# EAGLE design usb-c_passthrough (EAGLE 9.4.2)
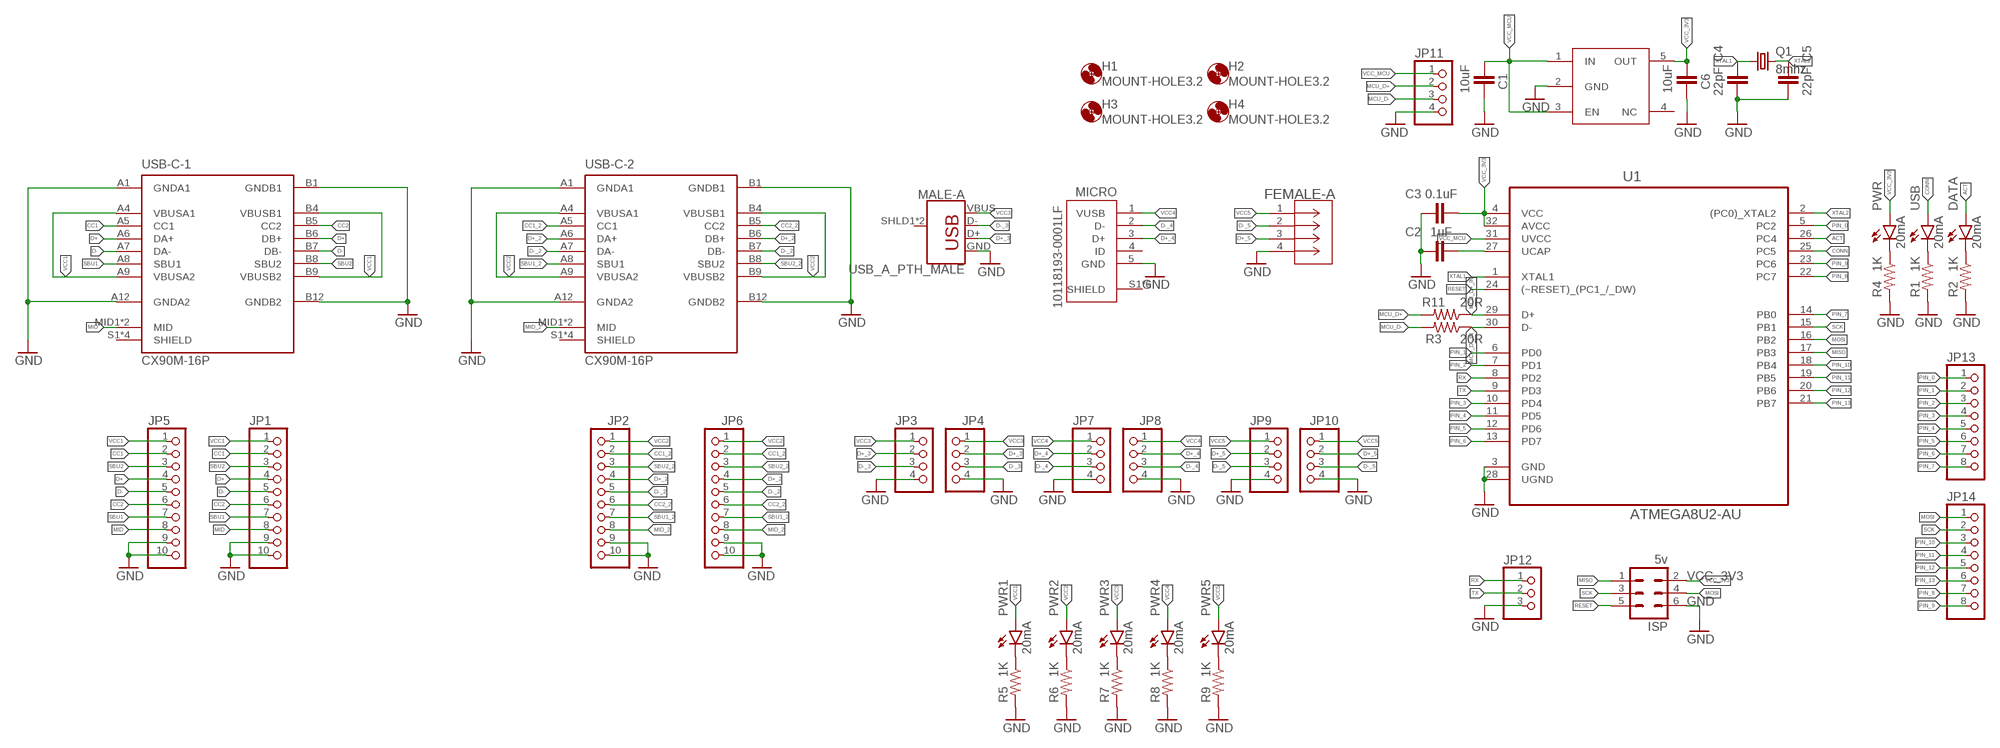
[diagram p0: schematic, sheet 1]

## Parts
3V3_REG  3v3 LDO  NCP718BSN330T1G  [NCP718BSN330T1G]
C1  10uF  C-EUC0603  [C0603]
C2  1uF  C-EUC0603  [C0603]
C3  0.1uF  C-EUC0603  [C0603]
C4  22pF  C-EUC0603  [C0603]
C5  22pF  C-EUC0603  [C0603]
C6  10uF  C-EUC0603  [C0603]
DATA  20mA  LEDCHIP-LED0603  [CHIP-LED0603]
FEMALE-A  292303-1  [CONN_292303-1]
H1  MOUNT-HOLE3.2  [3,2]
H2  MOUNT-HOLE3.2  [3,2]
H3  MOUNT-HOLE3.2  [3,2]
H4  MOUNT-HOLE3.2  [3,2]
ISP  5v  MA03-2  [MA03-2]
JP1  PINHD-1X10  [1X10]
JP2  PINHD-1X10  [1X10]
JP3  PINHD-1X4  [1X04]
JP4  PINHD-1X4  [1X04]
JP5  PINHD-1X10  [1X10]
JP6  PINHD-1X10  [1X10]
JP7  PINHD-1X4  [1X04]
JP8  PINHD-1X4  [1X04]
JP9  PINHD-1X4  [1X04]
JP10  PINHD-1X4  [1X04]
JP11  PINHD-1X4  [1X04]
JP12  PINHD-1X3  [1X03]
JP13  PINHD-1X8  [1X08]
JP14  PINHD-1X8  [1X08]
MALE-A  USB_A_PTH_MALE  [USB-A-H]
MICRO  10118193-0001LF  [FCI_10118193-0001LF]
PWR  20mA  LEDCHIP-LED0603  [CHIP-LED0603]
PWR1  20mA  LEDCHIP-LED0603  [CHIP-LED0603]
PWR2  20mA  LEDCHIP-LED0603  [CHIP-LED0603]
PWR3  20mA  LEDCHIP-LED0603  [CHIP-LED0603]
PWR4  20mA  LEDCHIP-LED0603  [CHIP-LED0603]
PWR5  20mA  LEDCHIP-LED0603  [CHIP-LED0603]
Q1  8mhz  CRYSTALHC49UP  [HC49UP]
R1  1K  10KOHM-0603-1/10W-1%  [0603]
R2  1K  10KOHM-0603-1/10W-1%  [0603]
R3  20R  10KOHM-0603-1/10W-1%  [0603]
R4  1K  10KOHM-0603-1/10W-1%  [0603]
R5  1K  10KOHM-0603-1/10W-1%  [0603]
R6  1K  10KOHM-0603-1/10W-1%  [0603]
R7  1K  10KOHM-0603-1/10W-1%  [0603]
R8  1K  10KOHM-0603-1/10W-1%  [0603]
R9  1K  10KOHM-0603-1/10W-1%  [0603]
R11  20R  10KOHM-0603-1/10W-1%  [0603]
U1  ATMEGA8U2-AU  [QFP80P900X900X120-32N]
USB  20mA  LEDCHIP-LED0603  [CHIP-LED0603]
USB-C-1  CX90M-16P  [HRS_CX90M-16P]
USB-C-2  CX90M-16P  [HRS_CX90M-16P]

## Nets
ACT: DATA.A U1.26(PC4)
CC1: JP1.2 JP5.2 USB-C-1.A5(CC1)
CC1_2: JP2.2 JP6.2 USB-C-2.A5(CC1)
CC2: JP1.6 JP5.6 USB-C-1.B5(CC2)
CC2_2: JP2.6 JP6.6 USB-C-2.B5(CC2)
CONN: U1.25(PC5) USB.A
D+: JP1.4 JP5.4 USB-C-1.A6(DA+) USB-C-1.B6(DB+)
D+_2: JP2.4 JP6.4 USB-C-2.A6(DA+) USB-C-2.B6(DB+)
D+_3: JP3.2 JP4.2 MALE-A.D+
D+_4: JP7.2 JP8.2 MICRO.3(D+)
D+_5: FEMALE-A.3 JP9.2 JP10.2
D-: JP1.5 JP5.5 USB-C-1.A7(DA-) USB-C-1.B7(DB-)
D-_2: JP2.5 JP6.5 USB-C-2.A7(DA-) USB-C-2.B7(DB-)
D-_3: JP3.3 JP4.3 MALE-A.D-
D-_4: JP7.3 JP8.3 MICRO.2(D-)
D-_5: FEMALE-A.2 JP9.3 JP10.3
GND: 3V3_REG.2(GND) C1.1 C2.1 C3.1 C4.2 C5.2 C6.1 FEMALE-A.4(GND) ISP.6 JP1.9 JP1.10 JP2.9 JP2.10 JP3.4 JP4.4 JP5.9 JP5.10 JP6.9 JP6.10 JP7.4 JP8.4 JP9.4 JP10.4 JP11.4 JP12.3 MALE-A.GND MICRO.5(GND) R1.2 R2.2 R4.2 R5.2 R6.2 R7.2 R8.2 R9.2 U1.3(GND) U1.28(UGND) USB-C-1.A1(GNDA1) USB-C-1.A12(GNDA2) USB-C-1.B1(GNDB1) USB-C-1.B12(GNDB2) USB-C-2.A1(GNDA1) USB-C-2.A12(GNDA2) USB-C-2.B1(GNDB1) USB-C-2.B12(GNDB2)
MCU_D+: JP11.2 R11.2
MCU_D+_IN: R11.1 U1.29(D+)
MCU_D-: JP11.3 R3.2
MCU_D-_IN: R3.1 U1.30(D-)
MID: JP1.8 JP5.8 USB-C-1.MID1(MID) USB-C-1.MID2(MID)
MID_2: JP2.8 JP6.8 USB-C-2.MID1(MID) USB-C-2.MID2(MID)
MISO: ISP.1 U1.17(PB3)
MOSI: ISP.4 JP14.1 U1.16(PB2)
N$1: DATA.C R2.1
N$2: C2.2 U1.27(UCAP)
N$3: R1.1 USB.C
N$4: PWR.C R4.1
N$5: PWR1.C R5.1
N$6: PWR2.C R6.1
N$7: PWR3.C R7.1
N$8: PWR4.C R8.1
N$9: PWR5.C R9.1
PIN_0: JP13.1 U1.5(PC2)
PIN_1: JP13.2 U1.6(PD0)
PIN_2: JP13.3 U1.7(PD1)
PIN_3: JP13.4 U1.10(PD4)
PIN_4: JP13.5 U1.11(PD5)
PIN_5: JP13.6 U1.12(PD6)
PIN_6: JP13.7 U1.13(PD7)
PIN_7: JP13.8 U1.14(PB0)
PIN_8: JP14.7 U1.22(PC7)
PIN_9: JP14.8 U1.23(PC6)
PIN_10: JP14.3 U1.18(PB4)
PIN_11: JP14.4 U1.19(PB5)
PIN_12: JP14.5 U1.20(PB6)
PIN_13: JP14.6 U1.21(PB7)
RESET: ISP.5 U1.24((~RESET)_(PC1_/_DW))
RX: JP12.1 U1.8(PD2)
SBU1: JP1.7 JP5.7 USB-C-1.A8(SBU1)
SBU1_2: JP2.7 JP6.7 USB-C-2.A8(SBU1)
SBU2: JP1.3 JP5.3 USB-C-1.B8(SBU2)
SBU2_2: JP2.3 JP6.3 USB-C-2.B8(SBU2)
SCK: ISP.3 JP14.2 U1.15(PB1)
TX: JP12.2 U1.9(PD3)
VCC1: JP1.1 JP5.1 PWR1.A USB-C-1.A4(VBUSA1) USB-C-1.A9(VBUSA2) USB-C-1.B4(VBUSB1) USB-C-1.B9(VBUSB2)
VCC2: JP2.1 JP6.1 PWR2.A USB-C-2.A4(VBUSA1) USB-C-2.A9(VBUSA2) USB-C-2.B4(VBUSB1) USB-C-2.B9(VBUSB2)
VCC3: JP3.1 JP4.1 MALE-A.VBUS PWR3.A
VCC4: JP7.1 JP8.1 MICRO.1(VUSB) PWR4.A
VCC5: FEMALE-A.1(PWR) JP9.1 JP10.1 PWR5.A
VCC_3V3: 3V3_REG.5(OUT) C3.2 C6.2 ISP.2 PWR.A U1.4(VCC) U1.32(AVCC)
VCC_MCU: 3V3_REG.1(IN) 3V3_REG.3(EN) C1.2 JP11.1 U1.31(UVCC)
XTAL1: C4.1 Q1.1 U1.1(XTAL1)
XTAL2: C5.1 Q1.2 U1.2((PC0)_XTAL2)
Unconnected: 3V3_REG.4(NC) MALE-A.SHLD1(SHIELD) MALE-A.SHLD2(SHIELD) MICRO.4(ID) MICRO.S1(SHIELD) MICRO.S2(SHIELD) MICRO.S3(SHIELD) MICRO.S4(SHIELD) MICRO.S5(SHIELD) MICRO.S6(SHIELD) USB-C-1.S1(SHIELD) USB-C-1.S2(SHIELD) USB-C-1.S3(SHIELD) USB-C-1.S4(SHIELD) USB-C-2.S1(SHIELD) USB-C-2.S2(SHIELD) USB-C-2.S3(SHIELD) USB-C-2.S4(SHIELD)

## Library data of the parts
3V3_REG = IC-packages_BIG-pack V1.0:NCP718BSN330T1G
C1-C6 = rcl:C-EU: CAPACITOR, European symbol; SPICEPREFIX: C
DATA PWR PWR1-PWR5 USB = led:LED: LED OSRAM: - CHIPLED LG R971, LG N971, LY N971, LG Q971, LY Q971, LO R971, LY R971 LH N974, LH R974 LS Q976, LO Q976, LY Q976 LO Q996 - Hyper CHIPLED LW Q18S LB Q993, LB Q99A, LB R99A - SideLED LS A670, LO A670, LY A670, LG A670, LP A670 LB A673, LV A673, LT A673, LW A673 LH A674 LY A675 LS A676, LA A676, LO A676, LY A676, LW A676 LS A679, LY A679, LG A679 - Hyper Micro SIDELED® LS Y876, LA Y876, LO Y876, LY Y876 LT Y87S - SmartLED LW L88C, LW L88S LB L89C, LB L89S, LG L890 LS L89K, LO L89K, LY L89K LS L896, LA L896, LO L896, LY L896 - TOPLED LS T670, LO T670, LY T670, LG T670, LP T670 LSG T670, LSP T670, LSY T670, LOP T670, LYG T670 LG T671, LOG T671, LSG T671 LB T673, LV T673, LT T673, LW T673 LH T674 LS T676, LA T676, LO T676, LY T676, LB T676, LH T676, LSB T676, LW T676 LB T67C, LV T67C, LT T67C, LS T67K, LO T67K, LY T67K, LW E67C LS E67B, LA E67B, LO E67B, LY E67B, LB E67C, LV E67C, LT E67C LW T67C LS T679, LY T679, LG T679 LS T770, LO T770, LY T770, LG T770, LP T770 LB T773, LV T773, LT T773, LW T773 LH T774 LS E675, LA E675, LY E675, LS T675 LS T776, LA T776, LO T776, LY T776, LB T776 LHGB T686 LT T68C, LB T68C - Hyper Mini TOPLED® LB M676 - Mini TOPLED Santana® LG M470 LS M47K, LO M47K, LY M47K Source: http://www.osram.convergy.de LUXEON: - LUMILED® LXK2-PW12-R00, LXK2-PW12-S00, LXK2-PW14-U00, LXK2-PW14-V00 LXK2-PM12-R00, LXK2-PM12-S00, LXK2-PM14-U00 LXK2-PE12-Q00, LXK2-PE12-R00, LXK2-PE12-S00, LXK2-PE14-T00, LXK2-PE14-U00 LXK2-PB12-K00, LXK2-PB12-L00, LXK2-PB12-M00, LXK2-PB14-N00, LXK2-PB14-P00, LXK2-PB14-Q00 LXK2-PR12-L00, LXK2-PR12-M00, LXK2-PR14-Q00, LXK2-PR14-R00 LXK2-PD12-Q00, LXK2-PD12-R00, LXK2-PD12-S00 LXK2-PH12-R00, LXK2-PH12-S00 LXK2-PL12-P00, LXK2-PL12-Q00, LXK2-PL12-R00 Source: www.luxeon.com KINGBRIGHT: KA-3528ASYC Source: www.kingbright.com
FEMALE-A = Type A USB Port:292303-1: Type A USB port; MANUFACTURER_PART_NUMBER: 2923031; VENDOR: Tyco Electronics
H1-H4 = holes:MOUNT-HOLE: MOUNTING HOLE with drill center marker
ISP = con-lstb:MA03-2: PIN HEADER; OC_FARNELL: unknown; OC_NEWARK: unknown
JP1 JP2 JP5 JP6 = pinhead:PINHD-1X10: PIN HEADER
JP3 JP4 JP7-JP11 = pinhead:PINHD-1X4: PIN HEADER
JP12 = pinhead:PINHD-1X3: PIN HEADER
JP13 JP14 = pinhead:PINHD-1X8: PIN HEADER
MALE-A = SparkFun-Connectors:USB_A: USB-A Connector Male and female variants, as well as PTH and SMT variants SparkFun Products: SparkFun XBee Explorer Dongle <https://www.sparkfun.com/products/11697> PTH Male SparkFun MicroView-USB Programmer <https://www.sparkfun.com/products/12924> SMT Male SparkFun USB Type A Female Breakout <https://www.sparkfun.com/products/12700> SMT Female; PROD_ID: CONN-08367; SF_ID: PRT-00437
MICRO = 10118193-0001LF:10118193-0001LF: Micro USB B Type Receptacle; AVAILABILITY: Unavailable; DESCRIPTION: Single Port 5 Contact Shielded SMT MICRO USB B-Type Receptacle; MF: Amphenol FCI; MP: 10118193-0001LF; PACKAGE: None; PRICE: None
Q1 = adafruit:CRYSTAL: CRYSTAL; OC_FARNELL: unknown; OC_NEWARK: unknown
R1-R9 R11 = SparkFun-Resistors:10KOHM: 10kΩ resistor A resistor is a passive two-terminal electrical component that implements electrical resistance as a circuit element. Resistors act to reduce current flow, and, at the same time, act to lower voltage levels within circuits. - Wikipedia; PROD_ID: RES-00824; VALUE: 10k
U1 = Atmel_By_element14_Batch_1-00:ATMEGA8U2-AU: Microcontroller with USB Controller; MPN: ATMEGA8U2-AU; OC_FARNELL: 1748535; OC_NEWARK: 26R5641; PACKAGE: TQFP-32; SUPPLIER: Atmel
USB-C-1 USB-C-2 = CX90M-16P:CX90M-16P: USB-C (USB TYPE-C) USB 3.1 (USB 3.1 Gen 2, Superspeed+) Receptacle Connector 24 (16+8 Dummy) Position Board Edge, Cutout; Surface Mount; Through Hole, Right Angle; AVAILABILITY: Unavailable; DESCRIPTION: USB-C _USB TYPE-C_ USB 3.1 _USB 3.1 Gen 2, Superspeed+_ Receptacle Connector 24 _16+8 Dummy_ Position Board Edge, Cutout; Surface Mount; Through Hole, Right Angle; MF: Hirose Electric Co Ltd; MP: CX90M-16P; PACKAGE: None; PRICE: None

## Board
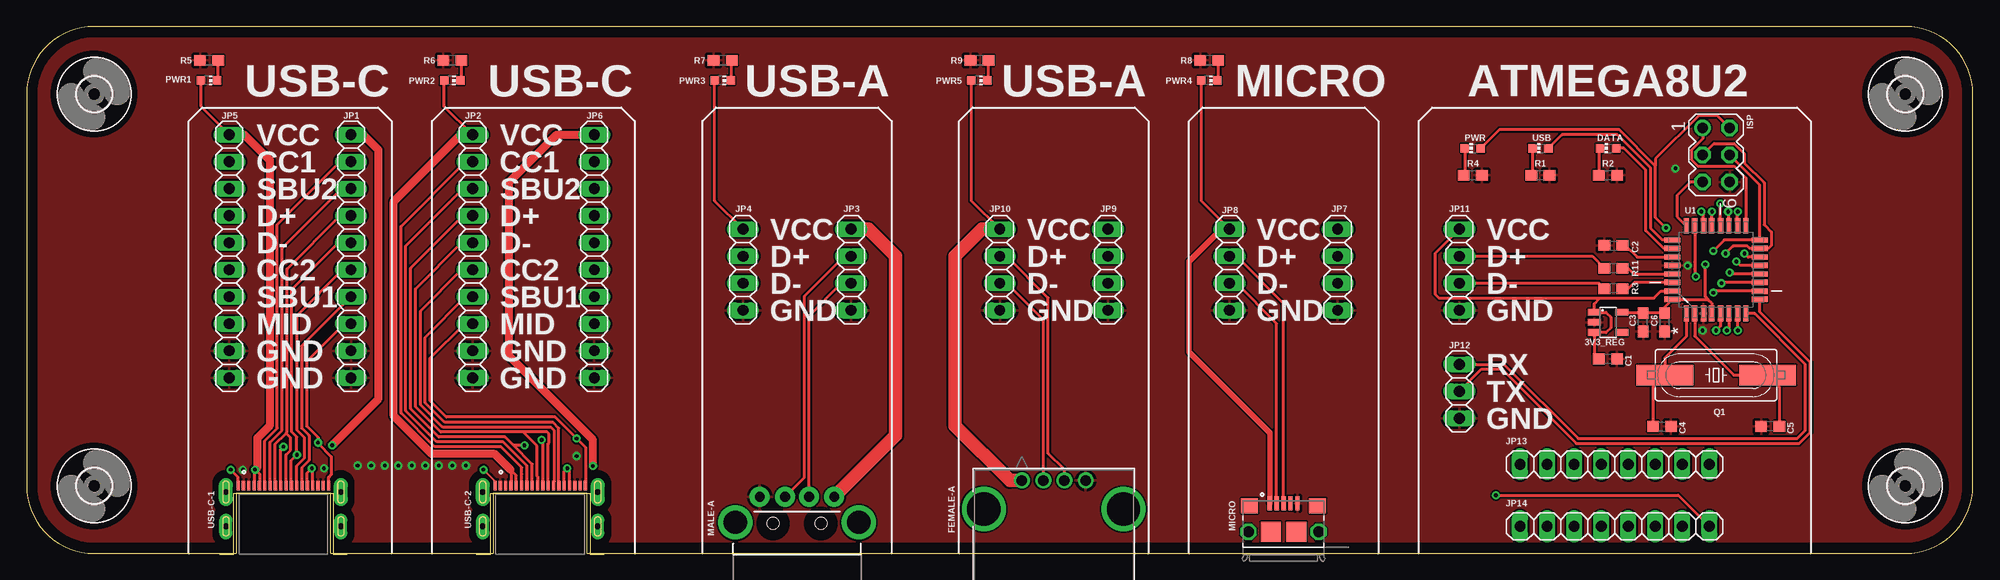
[diagram p1: board, top side]
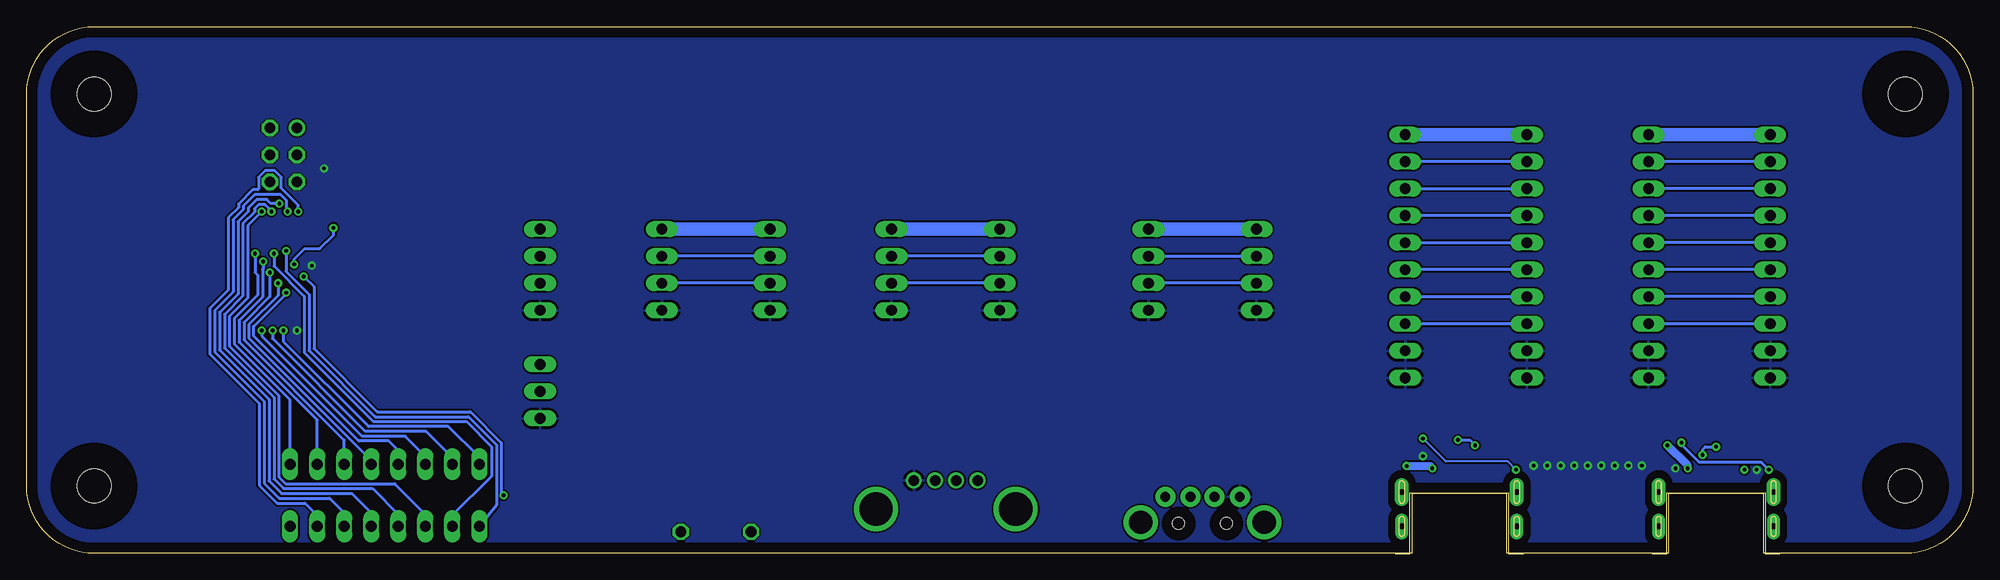
[diagram p2: board, bottom side, seen from below]

Size 182.88 x 49.53 mm. Coordinates in mm from the lower left corner, seen from the top.
Outline: 0,43.18 0,6.35 arc90 6.35,0 19.71,0 19.71,5.66 28.55,5.66 28.55,0 43.84,0 43.84,5.66 52.68,5.66 52.68,0 176.53,0 arc90 182.88,6.35 182.88,43.18 arc90 176.53,49.53 6.35,49.53 arc90 0,43.18
Copper layers (1*16): Top 0.035mm / dielectric 1.5mm / Bottom 0.035mm
Design rules "default": minimum track width 6mil, minimum drill 0.35mm, track to track 6mil, track to pad 6mil, pad to pad 6mil, via to via 6mil, smd to smd 6mil, copper to edge 40mil, drill to drill 6mil, minimum pad ring 10mil, minimum via ring 8mil, stop-mask expansion 4mil, vias tented up to drill 0mil, thermal gap 10mil

### Footprints (pad centres in the part's own frame; a part is rotated, then mirrored left to right if it is on the bottom)
NCP718BSN330T1G = smd 0.62 x 1.22: 1 -0.95,-1.3; 2 0,-1.3; 3 0.95,-1.3; 4 0.95,1.3; 5 -0.95,1.3
C0603 = smd 1.1 x 1: 1 -0.85,0; 2 0.85,0
CHIP-LED0603 = smd 0.8 x 0.8: A 0,-0.75; C 0,0.75
CONN_292303-1 = drill 0.991 pad 1.499: 1 -5.994,-2.032; 2 -3.988,-2.032; 3 -2.007,-2.032; 4 0,-2.032 | drill 3.124 pad 3.124: 6 -9.576,-4.724; 7 3.556,-4.724
3,2 = hole 3.2: 0,0
MA03-2 = drill 1.016: 1 -2.54,-1.27 | drill 1.016 octagon: 2 -2.54,1.27; 3 0,-1.27; 4 0,1.27; 5 2.54,-1.27; 6 2.54,1.27
1X10 = drill 1.016 long: 1 -11.43,0; 2 -8.89,0; 3 -6.35,0; 4 -3.81,0; 5 -1.27,0; 6 1.27,0; 7 3.81,0; 8 6.35,0; 9 8.89,0; 10 11.43,0
1X04 = drill 1.016 long: 1 -3.81,0; 2 -1.27,0; 3 1.27,0; 4 3.81,0
1X03 = drill 1.016 long: 1 -2.54,0; 2 0,0; 3 2.54,0
1X08 = drill 1.016 long: 1 -8.89,0; 2 -6.35,0; 3 -3.81,0; 4 -1.27,0; 5 1.27,0; 6 3.81,0; 7 6.35,0; 8 8.89,0
USB-A-H = drill 0.914 pad 1.88: D+ 2.4,1.127; D- 2.4,-1.127; GND 2.4,3.5; VBUS 2.4,-3.5 | drill 2.2: SHLD1 0,-5.8; SHLD2 0,5.8 | hole 1.1: -0.1,2.25; -0.1,-2.25
FCI_10118193-0001LF = smd 0.4 x 1.35: 1 -1.3,2.675; 2 -0.65,2.675; 3 0,2.675; 4 0.65,2.675; 5 1.3,2.675 | smd 1.6 x 1.4: S1 -3.2,2.45; S2 3.2,2.45 | smd 1.9 x 1.9: S3 1.2,0; S4 -1.2,0 | drill 1.016 pad 1.27 octagon: S5 -3.3,0; S6 3.3,0
HC49UP = smd 5.334 x 1.93: 1 -4.826,0; 2 4.826,0
0603 = smd 1.1 x 1: 1 -0.85,0; 2 0.85,0
QFP80P900X900X120-32N = smd 1.473 x 0.508: 1 -4.115,2.794; 2 -4.115,2.007; 3 -4.115,1.194; 4 -4.115,0.406; 5 -4.115,-0.406; 6 -4.115,-1.194; 7 -4.115,-2.007; 8 -4.115,-2.794; 17 4.115,-2.794; 18 4.115,-2.007; 19 4.115,-1.194; 20 4.115,-0.406; 21 4.115,0.406; 22 4.115,1.194; 23 4.115,2.007; 24 4.115,2.794 | smd 0.508 x 1.473: 9 -2.794,-4.115; 10 -2.007,-4.115; 11 -1.194,-4.115; 12 -0.406,-4.115; 13 0.406,-4.115; 14 1.194,-4.115; 15 2.007,-4.115; 16 2.794,-4.115; 25 2.794,4.115; 26 2.007,4.115; 27 1.194,4.115; 28 0.406,4.115; 29 -0.406,4.115; 30 -1.194,4.115; 31 -2.007,4.115; 32 -2.794,4.115
HRS_CX90M-16P = smd 0.3 x 0.9: A1 -3.75,3.85; A4 -2.75,3.85; A5 -1.75,3.85; A6 -0.75,3.85; A7 0.75,3.85; A8 1.75,3.85; A9 2.75,3.85; A12 3.75,3.85; B1 3.25,3.85; B4 2.25,3.85; B5 1.25,3.85; B6 0.25,3.85; B7 -0.25,3.85; B8 -1.25,3.85; B9 -2.25,3.85; B12 -3.25,3.85; MID1 -4.25,3.85; MID2 4.25,3.85 | drill 0.55 pad 1.3 long: S1 -5.4,3.23; S2 5.4,3.23 | drill 0.55 pad 1.225 long: S3 -5.4,0; S4 5.4,0

### Placement (x,y rotation side)
3V3_REG  148.59,21.72 270 top
C1  148.59,18.29 180 top
C2  149.1,28.96 0 top
C3  151.89,21.72 90 top
C4  153.67,11.94 0 top
C5  163.83,11.94 180 top
C6  153.92,21.72 90 top
DATA  148.59,38.1 90 top
FEMALE-A  99.52,8.89 0 top
H1  6.35,43.18 0 top
H2  6.35,6.35 0 top
H3  176.53,43.18 0 top
H4  176.53,6.35 0 top
ISP  158.75,37.47 270 top
JP1  30.48,27.94 270 top
JP2  41.91,27.94 270 top
JP3  77.47,26.67 270 top
JP4  67.31,26.67 270 top
JP5  19.05,27.94 270 top
JP6  53.34,27.94 270 top
JP7  123.19,26.67 270 top
JP8  113.03,26.67 270 top
JP9  101.6,26.67 270 top
JP10  91.44,26.67 270 top
JP11  134.62,26.67 270 top
JP12  134.62,15.24 270 top
JP13  149.22,8.38 0 top
JP14  149.22,2.54 0 top
MALE-A  72.39,2.92 90 top
MICRO  118.11,2.03 0 top
PWR  135.89,38.1 90 top
PWR1  17.14,44.45 270 top
PWR2  40.01,44.45 270 top
PWR3  65.41,44.45 270 top
PWR4  111.12,44.45 270 top
PWR5  89.53,44.45 270 top
Q1  158.75,16.76 0 top
R1  142.24,35.56 0 top
R2  148.59,35.56 0 top
R3  149.1,24.89 180 top
R4  135.89,35.56 0 top
R5  17.14,46.35 180 top
R6  40.01,46.35 180 top
R7  65.41,46.35 180 top
R8  111.12,46.35 180 top
R9  89.53,46.35 180 top
R11  149.1,26.8 180 top
U1  158.75,26.67 90 top
USB  142.24,38.1 90 top
USB-C-1  24.13,2.54 0 top
USB-C-2  48.26,2.54 0 top

### Tracks (layer width: path | path; a pad name or v marks a point on that pad's centre or on a via)
ACT
  Top 0.305: U1.26 153.82,28.68 152.15,30.35 152.15,36.06 150.1,38.1 DATA.A
CC1
  Top 0.305: USB-C-1.A5 22.38,10.59 23.55,11.76 23.55,30.92 29.46,36.83 JP1.2
  Bottom 0.305: JP5.2 JP1.2
CC1_2
  Top 0.305: USB-C-2.A5 46.51,7.44 46.53,7.46 46.53,8.08 44.58,10.03 38.35,10.03 35.18,13.21 35.18,30.73 41.27,36.83 JP2.2
  Bottom 0.305: JP2.2 JP6.2
CC2
  Top 0.305: JP1.6 29.72,26.67 25.38,22.33 25.38,11.6 26.08,10.9 26.08,8.94 25.38,8.23 USB-C-1.B5
  Bottom 0.305: JP5.6 JP1.6
CC2_2
  Top 0.305: JP2.6 40.89,26.67 37.01,22.78 37.01,13.97 39.11,11.86 49.27,11.86 49.55,11.58 49.55,6.75 49.51,6.71 USB-C-2.B5
  Bottom 0.305: JP2.6 JP6.6
CONN
  Top 0.305: U1.25 153.68,29.46 152.6,30.54 152.6,36.25 149.48,39.37 144.26,39.37 USB.A
D+
  Top 0.305: USB-C-1.A6 23.38,10.3 24.38,11.3 | 24.38,11.3 24.47,11.38 24.47,26.75 29.46,31.75 JP1.4 | USB-C-1.B6 24.38,9.27 24.81,9.7 24.81,10.87 24.38,11.3
  Bottom 0.305: JP5.4 JP1.4
D+_2  (via drill 0.35)
  Top 0.305: USB-C-2.A6 47.51,8.39 45.74,10.16 | JP2.4 41.02,31.75 36.09,26.82 36.09,13.59 38.73,10.95 44.96,10.95 45.74,10.16 | USB-C-2.B6 48.51,10.54 v48.39,10.67 | v46.78,10.16 45.74,10.16
  Bottom 0.305: JP2.4 JP6.4 | v48.39,10.67 47.28,10.67 v46.78,10.16
D+_3
  Top 0.305: JP3.2 76.83,27.94 73.06,24.16 73.06,7.12 MALE-A.D+
  Bottom 0.305: JP3.2 JP4.2
D+_4
  Top 0.305: JP8.2 113.67,27.94 118.11,23.5 MICRO.3
  Bottom 0.305: JP8.2 JP7.2
D+_5
  Top 0.305: JP10.2 92.08,27.94 95.99,24.03 95.99,9.42 97.51,7.9 FEMALE-A.3
  Bottom 0.305: JP10.2 JP9.2
D-  (via drill 0.35)
  Top 0.305: JP1.5 29.34,29.21 24.92,24.8 24.92,11.41 25.4,10.93 v25.4,9.27 24.88,8.75 USB-C-1.A7 | USB-C-1.B7 23.88,9.78 v24.13,10.03
  Bottom 0.305: JP5.5 JP1.5 | v25.4,9.27 25.4,9.78 25.15,10.03 v24.13,10.03
D-_2
  Top 0.305: USB-C-2.B7 48.01,7.24 47.97,7.28 47.97,10.11 46.67,11.4 | JP2.5 40.89,29.21 36.55,24.87 36.55,13.78 38.92,11.4 46.67,11.4 | 46.67,11.4 48.92,11.4 49.1,11.23 49.1,10.41 49.01,10.32 USB-C-2.A7
  Bottom 0.305: JP6.5 JP2.5
D-_3
  Top 0.305: MALE-A.D- 73.52,22.34 76.58,25.4 JP3.3
  Bottom 0.305: JP4.3 JP3.3
D-_4
  Top 0.305: JP8.3 113.67,25.4 117.46,21.61 MICRO.2
  Bottom 0.305: JP8.3 JP7.3
D-_5
  Top 0.305: JP10.3 92.08,25.4 95.53,21.95 FEMALE-A.2
  Bottom 0.305: JP10.3 JP9.3
GND  (via drill 0.35)
  other vias: 156.08,27.05 157.48,20.95 154.94,36.2 51.69,9.14 41.27,8.26 31.11,8.26 32.38,8.26 33.66,8.26 34.92,8.26 36.2,8.26 37.47,8.26 38.73,8.26 40.01,8.26 20.32,7.87 27.94,8
  pour Bottom: -2.54,53.34 185.42,53.34 185.42,-2.54 -2.54,-2.54
  pour Top: -2.54,53.34 185.42,53.34 185.42,-2.54 -2.54,-2.54
MCU_D+
  Top 0.305: JP11.2 147.1,27.94 R11.2
MCU_D+_IN
  Top 0.305: R11.1 150.5,26.8 151.03,26.26 U1.29
MCU_D-
  Top 0.305: JP11.3 147.74,25.4 R3.2
MCU_D-_IN
  Top 0.305: U1.30 151.08,25.48 150.5,24.89 R3.1
MID  (via drill 0.35)
  Top 0.305: JP1.8 29.84,21.59 26.29,18.04 26.29,11.98 27.38,10.89 v27.38,10.41 27.38,10.34 28.62,9.1 28.62,7.41 28.38,7.17 USB-C-1.MID2 | USB-C-1.MID1 19.88,7.17 v19.18,7.87
  Bottom 0.305: JP5.8 JP1.8 | v19.18,7.87 19.86,8.56 25.7,8.56 27.38,10.23 v27.38,10.41
MID_2  (via drill 0.35)
  Top 0.203: USB-C-2.MID1 44.01,6.79 v42.93,7.87
  Top 0.305: USB-C-2.MID2 52.51,9.97 v51.69,10.79 49.66,12.83 39.44,12.83 37.92,14.34 37.92,18.36 41.15,21.59 JP2.8
  Bottom 0.203: v42.93,7.87 43.69,8.64 49.53,8.64 v51.69,10.79
  Bottom 0.305: JP2.8 JP6.8
MISO
  Top 0.305: ISP.1 157.48,38.97 156.41,37.91 156.41,37.02 157.04,36.4 160.44,36.4 161.54,35.29 U1.17
MOSI  (via drill 0.35)
  Top 0.305: ISP.4 162.81,34.67 162.81,29.52 U1.16 159.51,29.46 v158.5,28.45
  Bottom 0.305: v158.5,28.45 158.5,26.5 156.34,24.35 156.34,19.08 150.12,12.85 141.37,12.85 138.74,10.22 138.74,4.52 JP14.1
N$1
  Top 0.305: DATA.C 147.74,38 R2.1
N$2
  Top 0.305: C2.2 150.24,28.96 151.33,27.86 U1.27
N$3
  Top 0.305: USB.C 141.49,35.66 R1.1
N$4
  Top 0.305: PWR.C 135.14,35.66 R4.1
N$5
  Top 0.305: PWR1.C 18,44.55 R5.1
N$6
  Top 0.305: PWR2.C 40.85,44.55 R6.1
N$7
  Top 0.305: PWR3.C 66.25,44.55 R7.1
N$8
  Top 0.305: PWR4.C 111.97,44.55 R8.1
N$9
  Top 0.305: PWR5.C 90.39,44.55 R9.1
PIN_0  (via drill 0.35)
  Top 0.305: U1.5 159.16,21.36 v158.75,20.95
  Bottom 0.305: v158.75,20.95 158.75,19.94 150.75,11.94 143.26,11.94 140.34,9.02 JP13.1
PIN_1  (via drill 0.35)
  Top 0.305: U1.6 159.94,21.13 v159.77,20.95
  Bottom 0.305: v159.77,20.95 159.77,20.19 151.05,11.48 145.34,11.48 142.88,9.02 JP13.2
PIN_2  (via drill 0.35)
  Top 0.305: U1.7 160.76,20.98 v160.78,20.95
  Bottom 0.305: v160.78,20.95 160.78,20.45 151.36,11.02 147.29,11.02 145.41,9.14 JP13.3
PIN_3  (via drill 0.35)
  Top 0.305: U1.10 158.65,24.66 v158.5,24.51
  Bottom 0.305: v158.5,24.51 158.5,24.38 161.54,21.34 161.54,20.45 151.66,10.57 148.84,10.57 147.96,9.68 JP13.4
PIN_4  (via drill 0.35)
  Top 0.305: U1.11 159.33,25.48 v159.26,25.4
  Bottom 0.305: v159.26,25.4 159.26,24.27 162,21.52 162,20.26 150.5,8.75 JP13.5
PIN_5  (via drill 0.35)
  Top 0.305: U1.12 160.17,26.26 v160.02,26.42
  Bottom 0.305: v160.02,26.42 160.02,24.15 162.46,21.71 162.46,20.07 153.03,10.64 JP13.6
PIN_6  (via drill 0.35)
  Top 0.305: U1.13 161.01,27.08 v160.66,27.43
  Bottom 0.305: v160.66,27.43 160.66,26.75 160.7,26.7 160.7,24.12 162.92,21.9 162.92,19.88 155.57,12.54 JP13.7
PIN_7  (via drill 0.35)
  Top 0.305: U1.14 161.75,27.86 v161.42,28.19
  Bottom 0.305: v161.42,28.19 161.42,26.42 161.16,26.16 161.16,24.31 163.37,22.09 163.37,19.69 158.12,14.43 JP13.8
PIN_8  (via drill 0.35)
  Top 0.305: U1.22 157.56,31.93 v157.35,32.13
  Bottom 0.305: v157.35,32.13 157.35,32.73 158.95,34.33 158.95,35.37 159.58,35.99 160.46,35.99 161.09,35.37 161.09,34.26 161.16,34.19 161.63,34.19 162.97,32.85 162.97,32.53 163.93,31.57 163.93,24.77 165.66,23.04 165.66,18.74 161.01,14.09 161.01,6.42 159.31,4.72 156.72,4.72 155.57,3.58 JP14.7
PIN_9  (via drill 0.35)
  Top 0.305: v156.84,26.04 156.74,26.14 156.74,26.75 156.77,26.77 156.77,27.33 156.74,27.36 U1.23 | v138.05,5.46 155.19,5.46 JP14.8
  Bottom 0.305: v156.84,26.04 155.88,25.07 155.88,19.27 149.93,13.31 141.18,13.31 138.28,10.41 138.28,5.69 v138.05,5.46
PIN_10  (via drill 0.35)
  Top 0.305: U1.18 160.76,32.11 v160.78,32.13
  Bottom 0.305: v160.78,32.13 162.1,30.81 162.1,24.01 163.83,22.28 163.83,19.5 159.18,14.85 159.18,7.18 158.56,6.55 148.28,6.55 145.41,3.68 JP14.3
PIN_11  (via drill 0.35)
  Top 0.305: U1.19 159.94,32.06 v159.87,32.13
  Bottom 0.305: v159.87,32.13 160.1,32.36 160.1,32.41 160.5,32.81 161.06,32.81 161.47,32.41 161.47,32.09 162.56,31 162.56,24.2 164.29,22.47 164.29,19.31 159.64,14.66 159.64,6.99 158.75,6.1 150.37,6.1 147.96,3.68 JP14.4
PIN_12  (via drill 0.35)
  Top 0.305: U1.20 159.16,32.87 v159.13,32.89
  Bottom 0.305: v159.13,32.89 159.93,32.89 160.31,33.27 161.25,33.27 162.05,32.47 162.05,32.15 163.01,31.19 163.01,24.39 164.74,22.66 164.74,19.12 160.1,14.47 160.1,6.8 158.94,5.64 152.32,5.64 150.5,3.81 JP14.5
PIN_13  (via drill 0.35)
  Top 0.305: U1.21 158.34,32.11 v158.37,32.13
  Bottom 0.305: v158.37,32.13 158.45,32.21 158.45,33.18 159,33.73 161.44,33.73 162.51,32.66 162.51,32.34 163.47,31.38 163.47,24.58 165.2,22.85 165.2,18.93 160.55,14.28 160.55,6.61 159.12,5.18 154.41,5.18 153.03,3.81 JP14.6
RESET
  Top 0.305: ISP.5 156.34,34.92 155.07,33.66 155.07,31.67 U1.24
RX
  Top 0.152: 161.55,22.55 U1.8
  Top 0.305: JP12.1 138.81,17.78 145.8,10.79 166.37,10.79 167.13,11.56 167.13,17.78 162.37,22.55 161.55,22.55
SBU1
  Top 0.305: JP1.7 25.84,19.49 25.84,11.79 26.54,11.09 26.54,8.75 25.88,8.09 USB-C-1.A8
  Bottom 0.305: JP5.7 JP1.7
SBU1_2
  Top 0.305: USB-C-2.A8 50.01,11.77 49.46,12.32 39.3,12.32 37.47,14.15 37.47,20.32 41.27,24.13 JP2.7
  Bottom 0.305: JP6.7 JP2.7
SBU2
  Top 0.305: USB-C-1.B8 22.88,10.45 24.01,11.57 24.01,28.71 29.59,34.29 JP1.3
  Bottom 0.305: JP5.3 JP1.3
SBU2_2
  Top 0.305: USB-C-2.B8 47.01,8.25 44.77,10.49 38.54,10.49 35.64,13.4 35.64,28.91 41.02,34.29 JP2.3
  Bottom 0.305: JP6.3 JP2.3
SCK  (via drill 0.35)
  Top 0.305: ISP.3 158.55,38.53 160.46,38.53 161.42,37.58 161.42,36.72 163.27,34.86 163.27,30.91 163.96,30.23 163.96,28.96 163.68,28.68 U1.15 161.9,28.68 161.7,28.88 160.32,28.88 v159.64,28.19
  Bottom 0.305: v159.64,28.19 159.64,27 156.8,24.16 156.8,18.89 150.31,12.39 141.55,12.39 139.19,10.03 139.19,7.25 142.88,3.57 JP14.2
TX
  Top 0.305: JP12.2 136.7,17.32 138.62,17.32 145.61,10.34 166.56,10.34 167.59,11.37 167.59,17.97 162.87,22.69 U1.9
VCC1  (via drill 0.35)
  Top 0.305: USB-C-1.B9 21.88,7.46 v21.46,7.87 21.38,7.79 USB-C-1.A4 | USB-C-1.B4 26.38,7.58 v26.8,8 26.88,7.92 USB-C-1.A9 | JP5.1 16.39,42.02 PWR1.A
  Top 0.762: v21.46,7.87 21.69,8.11 21.69,10.88 22.86,12.05 22.86,36.95 20.45,39.37 JP5.1 | v28.7,10.16 33.07,14.53 33.07,37.92 31.62,39.37 JP1.1
  Bottom 0.762: v26.8,8 26.8,8.26 v28.7,10.16
  Bottom 1.27: JP5.1 JP1.1
VCC2  (via drill 0.35)
  Top 0.305: USB-C-2.B4 50.51,7.71 v50.8,8 51.01,7.79 USB-C-2.A9 | USB-C-2.B9 46.01,7.33 45.51,7.83 | 45.47,7.87 45.51,7.83 | 45.51,7.83 USB-C-2.A4 | JP2.1 39.26,42.02 PWR2.A
  Top 0.762: 45.47,7.87 43.99,9.35 38.07,9.35 34.49,12.92 34.49,33.1 40.77,39.37 JP2.1 | v53.21,8.21 53.21,10.67 45.34,18.54 45.34,34.92 49.78,39.37 JP6.1
  Bottom 0.762: v50.8,8 51.02,8.22 v53.21,8.22 v53.21,8.21
  Bottom 1.27: JP2.1 JP6.1
VCC3
  Top 0.305: JP4.1 64.66,33.13 PWR3.A
  Top 1.27: JP3.1 79.12,30.48 81.66,27.94 81.66,11.09 MALE-A.VBUS
  Bottom 1.27: JP4.1 JP3.1
VCC4
  Top 0.305: JP8.1 110.38,33.13 PWR4.A
  Top 0.508: JP8.1 112.27,30.48 109.22,27.43 109.22,18.92 116.81,11.33 MICRO.1
  Bottom 1.27: JP8.1 JP7.1
VCC5
  Top 0.305: JP10.1 88.78,33.13 PWR5.A
  Top 1.27: FEMALE-A.1 92.38,6.86 87.25,11.99 87.25,27.94 89.79,30.48 JP10.1
  Bottom 1.27: JP10.1 JP9.1
VCC_3V3  (via drill 0.35)
  Top 0.305: 157.99,23.88 U1.32 153.92,23.16 C6.2 153.82,22.67 151.99,22.67 C3.2 151.79,22.67 3V3_REG.5 | U1.4 158.34,23.52 157.99,23.88 | 157.99,23.88 157.73,24.13 v157.73,27.18 | v154.05,30.61 153.06,31.6 153.06,36.44 | PWR.A 138.37,39.83 149.67,39.83 153.06,36.44 | ISP.2 158.88,41.15 157.11,41.15 153.06,37.09 153.06,36.44
  Bottom 0.305: v154.05,30.61 154.05,29.92 155.32,28.65 156.77,28.65 157.73,27.69 v157.73,27.18
VCC_MCU
  Top 0.305: JP11.1 132.33,28.19 132.33,24.38 132.72,24 147.83,24 | U1.31 153.57,24.66 152.91,24 147.83,24 | 147.83,24 147.29,23.46 3V3_REG.1 148.4,22.67 148.84,22.23 148.84,21.21 148.4,20.77 3V3_REG.3 147.29,18.74 C1.2
XTAL1
  Top 0.305: U1.1 155.96,20.4 153.92,18.36 Q1.1 152.82,15.66 C4.1
XTAL2
  Top 0.305: U1.2 156.74,20.42 160.4,16.76 Q1.2 164.68,15.66 C5.1

### Text on the board
tPlace: USB-C | USB-C | USB-A | USB-A | MICRO | ATMEGA8U2 | VCC | VCC | CC1 | CC1 | SBU2 | SBU2 | D+ | D+ | VCC | VCC | VCC | VCC | D- | D- | D+ | D+ | D+ | D+ | CC2 | CC2 | D- | D- | D- | D- | SBU1 | SBU1 | GND | GND | GND | GND | MID | MID | GND | GND | RX | GND | GND | TX | GND